# EAGLE design LV Relay Board v6 (EAGLE 7.2.0)
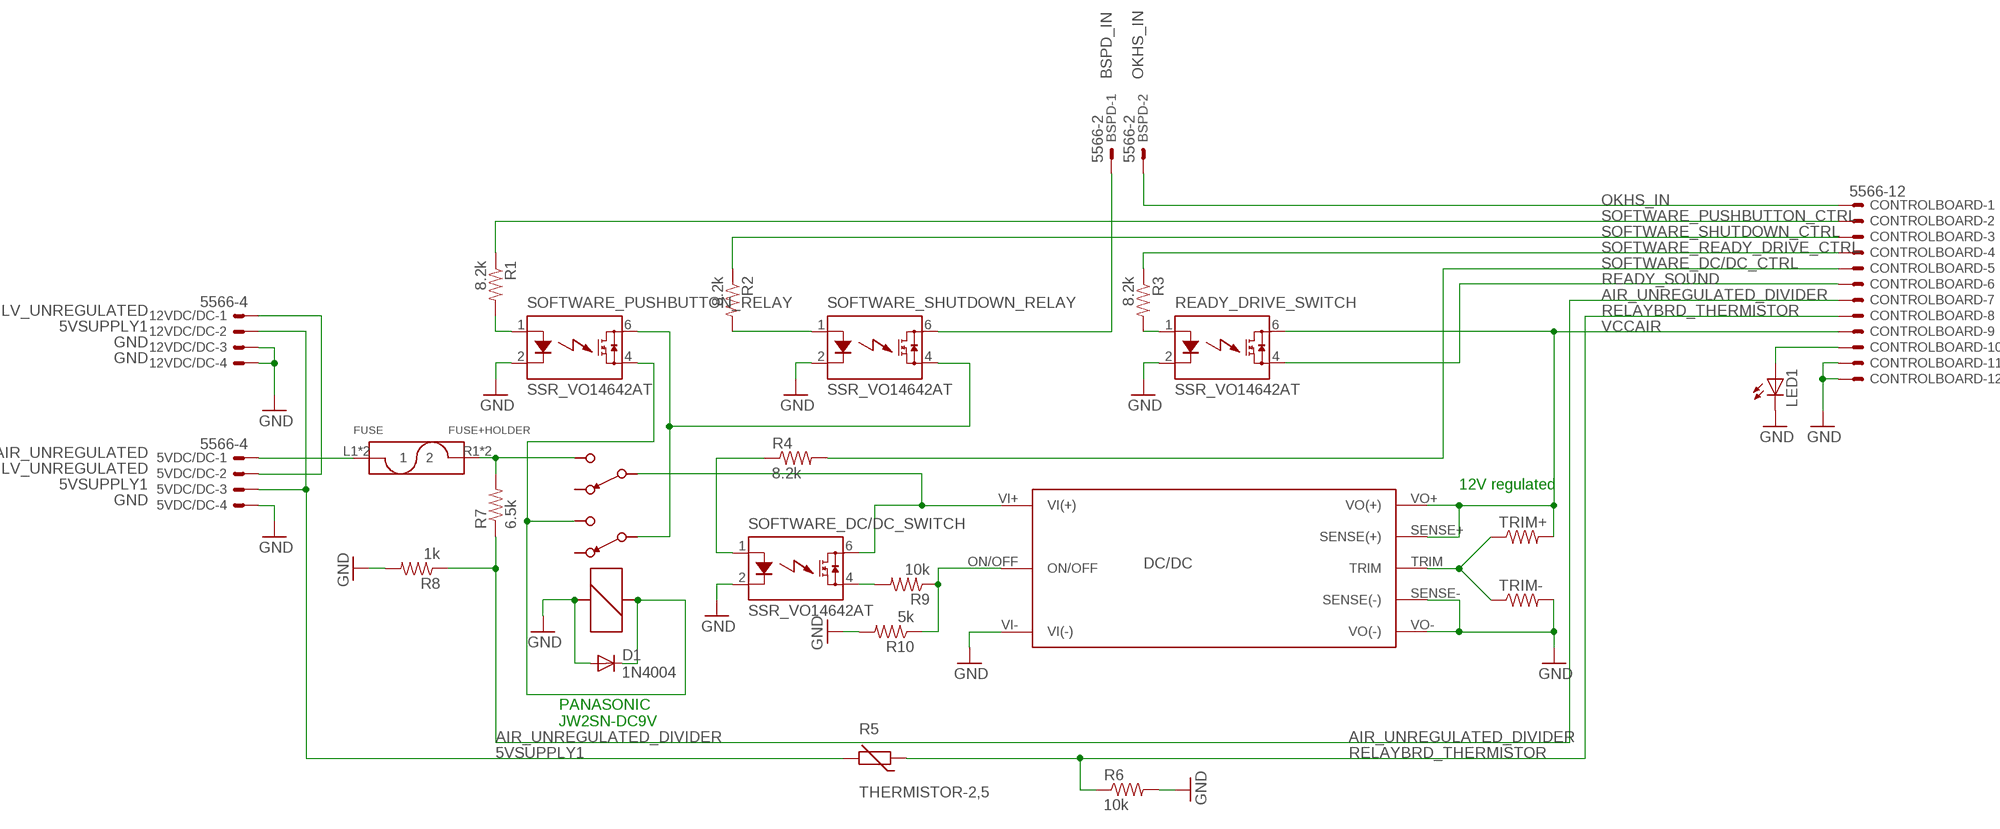
[diagram p0: schematic, sheet 1]

## Parts
5VDC/DC  5566-4  [5566-4]
12VDC/DC  5566-4  [5566-4]
BSPD  5566-2  [5566-2]
CONTROLBOARD  5566-12  [5566-12]
D1  1N4004  [DO41-10]
DC/DC  DC/DC-EIGHTH_BRICKUWE-12/10-Q12PB-C  [DC/DC-EIGHTH_BRICK]
FUSE  FUSE+HOLDER  [FUSE-HOLDER]
LED1  LED3MM  [LED3MM]
PANASONIC_JW2SN-DC9V_RELAY  PANASONIC_JW2SN-DC9V_RELAY  [PANASONIC_JW2SN-DC9V_RELAY]
R1  8.2k  RESISTORPTH-1/4W  [AXIAL-0.4]
R2  8.2k  RESISTORPTH-1/4W  [AXIAL-0.4]
R3  8.2k  RESISTORPTH-1/4W  [AXIAL-0.4]
R4  8.2k  RESISTORPTH-1/4W  [AXIAL-0.4]
R5  THERMISTOR-2,5  [RS-2,5]
R6  10k  RESISTORPTH-1/4W  [AXIAL-0.4]
R7  6.5k  RESISTORPTH-1/4W  [AXIAL-0.4]
R8  1k  RESISTORPTH-1/4W  [AXIAL-0.4]
R9  10k  RESISTORPTH-1/4W  [AXIAL-0.4]
R10  5k  RESISTORPTH-1/4W  [AXIAL-0.4]
READY_DRIVE_SWITCH  SSR_VO14642AT  [DIL06]
SOFTWARE_DC/DC_SWITCH  SSR_VO14642AT  [DIL06]
SOFTWARE_PUSHBUTTON_RELAY  SSR_VO14642AT  [DIL06]
SOFTWARE_SHUTDOWN_RELAY  SSR_VO14642AT  [DIL06]
TRIM+  RESISTORPTH-1/4W  [AXIAL-0.4]
TRIM-  RESISTORPTH-1/4W  [AXIAL-0.4]

## Nets
5VSUPPLY1: 5VDC/DC.3 12VDC/DC.2 R5.2
AIR_UNREGULATED: 5VDC/DC.1 FUSE.L1 FUSE.L2
AIR_UNREGULATED_DIVIDER: CONTROLBOARD.7 R7.P$1 R8.P$1
BSPD_IN: BSPD.1 SOFTWARE_SHUTDOWN_RELAY.6(IO1)
GND: 5VDC/DC.4 12VDC/DC.3 12VDC/DC.4 CONTROLBOARD.11 CONTROLBOARD.12 D1.A DC/DC.SENSE-(SENSE(-)) DC/DC.VI-(VI(-)) DC/DC.VO-(VO(-)) LED1.K(C) PANASONIC_JW2SN-DC9V_RELAY.COIL+ R6.P$2 R8.P$2 R10.P$2 READY_DRIVE_SWITCH.2(LED-) SOFTWARE_DC/DC_SWITCH.2(LED-) SOFTWARE_PUSHBUTTON_RELAY.2(LED-) SOFTWARE_SHUTDOWN_RELAY.2(LED-) TRIM-.P$2
LV_UNREGULATED: 5VDC/DC.2 12VDC/DC.1
N$1: R9.P$2 SOFTWARE_DC/DC_SWITCH.4(IO2)
N$2: DC/DC.VI+(VI(+)) PANASONIC_JW2SN-DC9V_RELAY.6 SOFTWARE_DC/DC_SWITCH.6(IO1)
N$3: FUSE.R1 FUSE.R2 PANASONIC_JW2SN-DC9V_RELAY.5 R7.P$2
N$4: PANASONIC_JW2SN-DC9V_RELAY.3 SOFTWARE_PUSHBUTTON_RELAY.6(IO1) SOFTWARE_SHUTDOWN_RELAY.4(IO2)
N$5: R1.P$2 SOFTWARE_PUSHBUTTON_RELAY.1(LED+)
N$6: D1.C PANASONIC_JW2SN-DC9V_RELAY.4 PANASONIC_JW2SN-DC9V_RELAY.COIL- SOFTWARE_PUSHBUTTON_RELAY.4(IO2)
N$7: R2.P$2 SOFTWARE_SHUTDOWN_RELAY.1(LED+)
N$8: DC/DC.TRIM TRIM+.P$1 TRIM-.P$1
N$9: R3.P$2 READY_DRIVE_SWITCH.1(LED+)
N$10: R4.P$1 SOFTWARE_DC/DC_SWITCH.1(LED+)
N$11: DC/DC.ON/OFF R9.P$1 R10.P$1
N$13: CONTROLBOARD.10 LED1.A
OKHS_IN: BSPD.2 CONTROLBOARD.1
READY_SOUND: CONTROLBOARD.6 READY_DRIVE_SWITCH.4(IO2)
RELAYBRD_THERMISTOR: CONTROLBOARD.8 R5.1 R6.P$1
SOFTWARE_DC/DC_CTRL: CONTROLBOARD.5 R4.P$2
SOFTWARE_PUSHBUTTON_CTRL: CONTROLBOARD.2 R1.P$1
SOFTWARE_READY_DRIVE_CTRL: CONTROLBOARD.4 R3.P$1
SOFTWARE_SHUTDOWN_CTRL: CONTROLBOARD.3 R2.P$1
VCCAIR: CONTROLBOARD.9 DC/DC.SENSE+(SENSE(+)) DC/DC.VO+(VO(+)) READY_DRIVE_SWITCH.6(IO1) TRIM+.P$2
Unconnected: PANASONIC_JW2SN-DC9V_RELAY.2 PANASONIC_JW2SN-DC9V_RELAY.7

## Notes on the sheet
- 12V regulated
- PANASONIC
  JW2SN-DC9V

## Library data of the parts
5VDC/DC 12VDC/DC = con-molex:5566-4: Mini FIT connector 4 pol Source: http://www.molex.com; OC_FARNELL: unknown; OC_NEWARK: unknown
BSPD = con-molex:5566-2: Mini FIT connector 2 pol Source: http://www.molex.com; OC_FARNELL: 1822072; OC_NEWARK: unknown
CONTROLBOARD = con-molex:5566-12: Mini FIT connector 12 pol Source: http://www.molex.com; OC_FARNELL: unknown; OC_NEWARK: unknown
D1 = diode:1N4004: DIODE general purpose rectifier, 1 A
DC/DC = HyTech 2016:DC/DC-EIGHTH_BRICK: Eighth Brick DC/DC
FUSE = HyTech 2016:FUSE+HOLDER
LED1 = adafruit:LED: LED OSRAM: - CHIPLED LG R971, LG N971, LY N971, LG Q971, LY Q971, LO R971, LY R971 LH N974, LH R974 LS Q976, LO Q976, LY Q976 LO Q996 - Hyper CHIPLED LW Q18S LB Q993, LB Q99A, LB R99A - SideLED LS A670, LO A670, LY A670, LG A670, LP A670 LB A673, LV A673, LT A673, LW A673 LH A674 LY A675 LS A676, LA A676, LO A676, LY A676, LW A676 LS A679, LY A679, LG A679 - Hyper Micro SIDELED® LS Y876, LA Y876, LO Y876, LY Y876 LT Y87S - SmartLED LW L88C, LW L88S LB L89C, LB L89S, LG L890 LS L89K, LO L89K, LY L89K LS L896, LA L896, LO L896, LY L896 - TOPLED LS T670, LO T670, LY T670, LG T670, LP T670 LSG T670, LSP T670, LSY T670, LOP T670, LYG T670 LG T671, LOG T671, LSG T671 LB T673, LV T673, LT T673, LW T673 LH T674 LS T676, LA T676, LO T676, LY T676, LB T676, LH T676, LSB T676, LW T676 LB T67C, LV T67C, LT T67C, LS T67K, LO T67K, LY T67K, LW E67C LS E67B, LA E67B, LO E67B, LY E67B, LB E67C, LV E67C, LT E67C LW T67C LS T679, LY T679, LG T679 LS T770, LO T770, LY T770, LG T770, LP T770 LB T773, LV T773, LT T773, LW T773 LH T774 LS E675, LA E675, LY E675, LS T675 LS T776, LA T776, LO T776, LY T776, LB T776 LHGB T686 LT T68C, LB T68C - Hyper Mini TOPLED® LB M676 - Mini TOPLED Santana® LG M470 LS M47K, LO M47K, LY M47K Source: http://www.osram.convergy.de/
PANASONIC_JW2SN-DC9V_RELAY = HyTech 2016:PANASONIC_JW2SN-DC9V_RELAY
R1-R4 R6-R10 TRIM+ TRIM- = HyTech 2016:RESISTOR: Resistor Basic schematic elements and footprints for 0603, 1206, and PTH resistors.
R5 = varistor:THERMISTOR: THERMISTOR
READY_DRIVE_SWITCH SOFTWARE_DC/DC_SWITCH SOFTWARE_PUSHBUTTON_RELAY SOFTWARE_SHUTDOWN_RELAY = HyTech 2016:SSR_: Configured for DC only

## Board
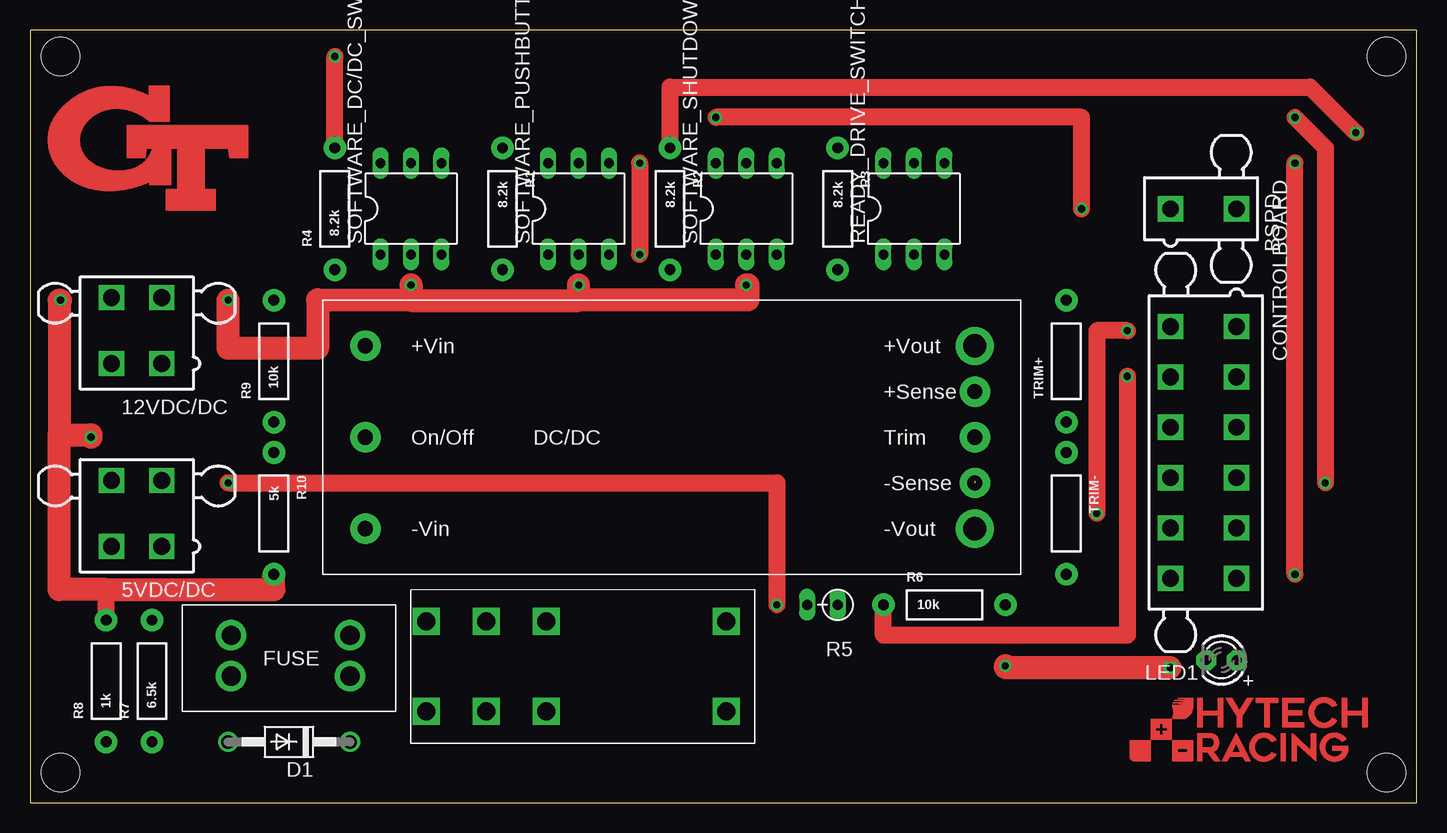
[diagram p1: board, top side]
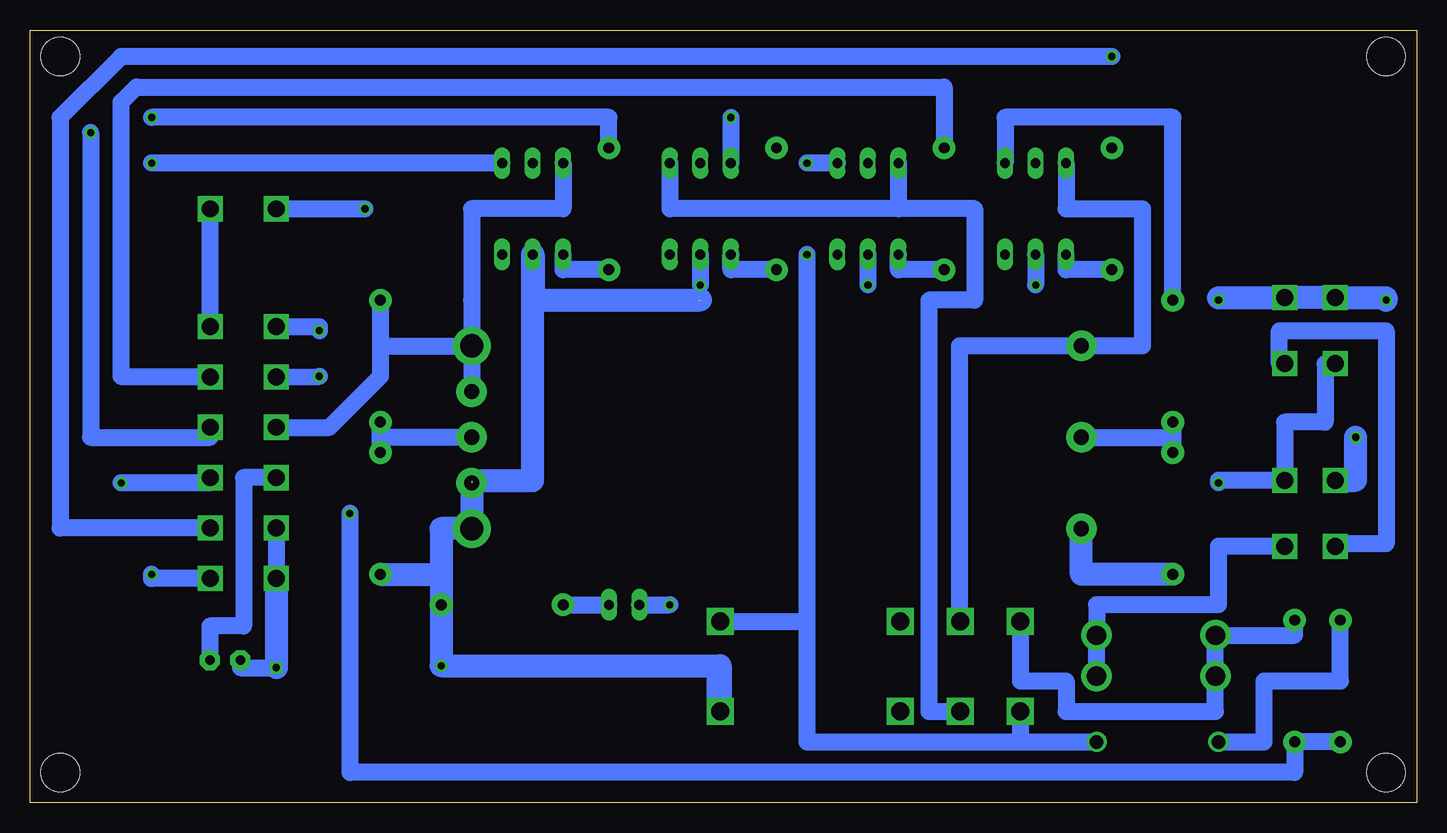
[diagram p2: board, bottom side, seen from below]

Size 115.55 x 64.44 mm. Coordinates in mm from the lower left corner, seen from the top.
Outline: 0,0 115.55,0 115.55,64.44 0,64.44 0,0
Copper layers (1*16): Top 0.035mm / dielectric 1.5mm / Bottom 0.035mm
Design rules "default": minimum track width 10mil, minimum drill 24mil, track to track 8mil, track to pad 8mil, pad to pad 8mil, via to via 8mil, smd to smd 8mil, copper to edge 40mil, drill to drill 8mil, minimum pad ring 10mil, minimum via ring 8mil, stop-mask expansion 4mil, vias tented up to drill 0mil, thermal gap 10mil
Holes 3.2 mm at 2.54,62.23 2.54,2.54 113.03,2.54 113.03,62.23

### Footprints (pad centres in the part's own frame; a part is rotated, then mirrored left to right if it is on the bottom)
5566-4 = drill 1.4 square: 1 2.1,-2.75; 2 -2.1,-2.75; 3 2.1,2.75; 4 -2.1,2.75
5566-2 = drill 1.4 square: 1 0,-2.75; 2 0,2.75
5566-12 = drill 1.4 square: 1 10.5,-2.75; 2 6.3,-2.75; 3 2.1,-2.75; 4 -2.1,-2.75; 5 -6.3,-2.75; 6 -10.5,-2.75; 7 10.5,2.75; 8 6.3,2.75; 9 2.1,2.75; 10 -2.1,2.75; 11 -6.3,2.75; 12 -10.5,2.75
DO41-10 = drill 1.118: A 5.08,0; C -5.08,0
DC/DC-EIGHTH_BRICK = drill 1.27 pad 2.54: ON/OFF 0,-7.62; SENSE+ 50.8,-3.81; SENSE- 50.8,-11.43; TRIM 50.8,-7.62; VI+ 0,0; VI- 0,-15.24 | drill 1.93 pad 3.175: VO+ 50.8,0; VO- 50.8,-15.24
FUSE-HOLDER = drill 1.6 pad 2.54: L1 0,3.404; L2 0,0; R1 9.906,3.404; R2 9.906,0
LED3MM = drill 0.813 pad 1.676 octagon: A -1.27,0; K 1.27,0
PANASONIC_JW2SN-DC9V_RELAY = drill 1.5 square: 2 10.008,0; 3 5.004,0; 4 0,0; 5 0,7.493; 6 5.004,7.493; 7 10.008,7.493; COIL+ 25.019,0; COIL- 25.019,7.493
AXIAL-0.4 = drill 0.9 pad 1.88: P$1 -5.08,0; P$2 5.08,0
RS-2,5 = drill 0.813 long: 1 -1.27,0; 2 1.27,0
DIL06 = drill 0.813 long: 1 -2.54,-3.81; 2 0,-3.81; 3 2.54,-3.81; 4 2.54,3.81; 5 0,3.81; 6 -2.54,3.81

### Placement (x,y rotation side)
5VDC/DC  8.89,24.13 0 top
12VDC/DC  8.89,39.37 0 top
BSPD  97.79,49.53 270 top
CONTROLBOARD  97.79,29.21 90 top
D1  21.59,5.08 180 top
DC/DC  27.94,38.1 0 top
FUSE  26.67,13.97 180 top
LED1  99.29,11.89 180 top
PANASONIC_JW2SN-DC9V_RELAY  33.02,7.62 0 top
R1  39.37,49.53 270 top
R2  53.34,49.53 270 top
R3  67.31,49.53 270 top
R4  25.4,49.53 90 top
R5  66.04,16.51 180 top
R6  76.2,16.51 0 top
R7  10.16,10.16 90 top
R8  6.35,10.16 90 top
R9  20.32,36.83 90 top
R10  20.32,24.13 270 top
READY_DRIVE_SWITCH  73.66,49.53 0 top
SOFTWARE_DC/DC_SWITCH  31.75,49.53 0 top
SOFTWARE_PUSHBUTTON_RELAY  45.72,49.53 0 top
SOFTWARE_SHUTDOWN_RELAY  59.69,49.53 0 top
TRIM+  86.36,36.83 90 top
TRIM-  86.36,24.13 270 top

### Tracks (layer width: path | path; a pad name or v marks a point on that pad's centre or on a via)
5VSUPPLY1  (via drill 0.6)
  Top 1.422: v16.51,26.67 62.23,26.67 v62.23,16.51
  Bottom 1.422: 12VDC/DC.2 7.62,36.62 7.62,31.75 10.99,31.75 5VDC/DC.3 16.51,26.88 v16.51,26.67 | R5.2 v62.23,16.51
AIR_UNREGULATED
  Bottom 1.422: FUSE.L1 FUSE.L2 26.67,16.51 16.51,16.51 16.51,21.38 5VDC/DC.1
AIR_UNREGULATED_DIVIDER  (via drill 0.6)
  Top 1.422: v91.44,39.37 88.9,39.37 v88.9,24.13
  Bottom 1.422: R8.P$1 R7.P$1 10.16,2.54 88.9,2.54 v88.9,24.13 | CONTROLBOARD.7 91.44,39.71 v91.44,39.37
BSPD_IN  (via drill 0.6)
  Top 1.422: v87.63,49.53 87.63,57.15 v57.15,57.15
  Bottom 1.422: BSPD.1 v87.63,49.53 | v57.15,57.15 SOFTWARE_SHUTDOWN_RELAY.6
GND  (via drill 0.6)  (2 unrouted)
  Top 1.422: R8.P$2 6.35,17.78 2.54,17.78
  Top 1.93: v31.75,43.18 v31.76,43.18 31.76,41.91 | 31.76,41.91 31.76,41.89 45.72,41.89 v45.72,43.18 45.72,41.92 59.81,41.92 59.81,43.18 v59.69,43.18 | 31.76,41.91 24.02,41.95 23.97,41.95 23.97,37.89 16.51,37.89 v16.51,41.91 | v2.54,41.91 2.42,41.91 2.42,30.69 | 2.42,30.69 5.08,30.69 v5.08,30.48 | 2.42,30.69 2.42,17.78 6.35,17.78 20.32,17.78 R10.P$2 | v95.02,11.27 81.28,11.27 v81.28,11.43
  Bottom 1.422: CONTROLBOARD.11 CONTROLBOARD.12 95.25,18.71 | SOFTWARE_SHUTDOWN_RELAY.2 v59.69,43.18 | D1.A 12.7,5.08 12.7,10.16 6.35,10.16 R8.P$2 | 16.51,42.12 v16.51,41.91 | SOFTWARE_DC/DC_SWITCH.2 v31.75,43.18 | SOFTWARE_PUSHBUTTON_RELAY.2 v45.72,43.18 | LED1.K 98.01,11.89 98.01,11.27 v95.02,11.27
  Bottom 1.93: R6.P$2 81.28,22.86 DC/DC.VO- 78.74,26.84 73.68,26.84 73.68,45.72 READY_DRIVE_SWITCH.2 73.63,45.72 73.63,41.92 59.69,41.92 | 16.51,42.12 12VDC/DC.3 12VDC/DC.4 | 12VDC/DC.4 2.54,42.12 v2.54,41.91 | 5VDC/DC.4 5.08,26.88 v5.08,30.48 | R10.P$2 27.94,19.05 DC/DC.VI- | R6.P$2 v81.28,11.43 58.04,11.43 PANASONIC_JW2SN-DC9V_RELAY.COIL+ 58.2,7.62 58.2,10.88 | TRIM-.P$2 81.28,19.05 R6.P$2 | CONTROLBOARD.12 95.02,18.71 v95.02,11.27 | 12VDC/DC.4 7.4,42.12 7.4,42.1
LV_UNREGULATED
  Bottom 1.422: 12VDC/DC.1 11.43,36.62 11.43,39.37 2.54,39.37 2.54,21.59 6.79,21.59 5VDC/DC.2
N$1
  Bottom 1.422: R9.P$2 20.32,57.15 34.29,57.15 SOFTWARE_DC/DC_SWITCH.4
N$2
  Bottom 1.422: SOFTWARE_DC/DC_SWITCH.6 29.21,49.53 22.86,49.53 22.86,38.1 DC/DC.VI+ 38.1,38.1 38.1,15.11 PANASONIC_JW2SN-DC9V_RELAY.6
N$3
  Bottom 1.422: R7.P$2 10.16,13.97 FUSE.R2 FUSE.R1 16.76,7.62 29.21,7.62 29.21,10.16 33.02,10.16 PANASONIC_JW2SN-DC9V_RELAY.5
N$4
  Bottom 1.422: SOFTWARE_PUSHBUTTON_RELAY.6 43.18,49.53 | PANASONIC_JW2SN-DC9V_RELAY.3 40.64,7.62 40.64,41.91 36.83,41.91 36.83,49.53 43.18,49.53 | SOFTWARE_SHUTDOWN_RELAY.4 62.23,49.53 43.18,49.53
N$5
  Bottom 1.422: R1.P$2 43.18,44.45 SOFTWARE_PUSHBUTTON_RELAY.1
N$6  (via drill 0.6)
  Top 1.422: v50.8,53.34 v50.8,45.72
  Bottom 1.422: SOFTWARE_PUSHBUTTON_RELAY.4 v50.8,53.34 | PANASONIC_JW2SN-DC9V_RELAY.4 33.02,5.08 | 33.02,5.08 D1.C | PANASONIC_JW2SN-DC9V_RELAY.COIL- 50.8,15.11 | 50.8,15.11 50.8,5.08 33.02,5.08 | v50.8,45.72 50.8,15.11
N$7
  Bottom 1.422: SOFTWARE_SHUTDOWN_RELAY.1 57.15,44.45 R2.P$2
N$8
  Bottom 1.422: DC/DC.TRIM 86.36,30.48 | 86.36,30.48 TRIM+.P$1 | TRIM-.P$1 86.36,30.48
N$9
  Bottom 1.422: R3.P$2 71.12,44.45 READY_DRIVE_SWITCH.1
N$10
  Bottom 1.422: R4.P$1 29.21,44.45 SOFTWARE_DC/DC_SWITCH.1
N$11
  Bottom 1.422: R9.P$1 20.32,30.48 | 20.32,30.48 R10.P$1 | DC/DC.ON/OFF 20.32,30.48
N$13
  Bottom 1.422: CONTROLBOARD.10 97.74,27.11 97.74,14.74 100.56,14.74 LED1.A
OKHS_IN
  Bottom 1.422: CONTROLBOARD.1 BSPD.2
READY_SOUND  (via drill 0.6)
  Top 1.422: v105.41,19.05 v105.41,53.34
  Bottom 1.422: CONTROLBOARD.6 105.41,18.71 v105.41,19.05 | READY_DRIVE_SWITCH.4 v105.41,53.34
RELAYBRD_THERMISTOR  (via drill 0.6)
  Top 1.422: v91.44,35.56 91.44,13.97 71.12,13.97 R6.P$1
  Bottom 1.422: R6.P$1 R5.1 | CONTROLBOARD.8 v91.44,35.56
SOFTWARE_DC/DC_CTRL  (via drill 0.6)
  Top 1.422: R4.P$2 v25.4,62.23
  Bottom 1.422: CONTROLBOARD.5 113.03,22.91 113.03,57.15 107.95,62.23 v25.4,62.23
SOFTWARE_PUSHBUTTON_CTRL
  Bottom 1.422: CONTROLBOARD.2 107.9,35.51 107.95,35.56 107.95,58.42 106.68,59.69 39.37,59.69 R1.P$1
SOFTWARE_READY_DRIVE_CTRL  (via drill 0.6)
  Top 1.422: v107.95,26.67 107.95,54.61 v105.41,57.15
  Bottom 1.422: R3.P$1 67.31,57.15 v105.41,57.15 | CONTROLBOARD.4 100.54,26.67 v107.95,26.67
SOFTWARE_SHUTDOWN_CTRL  (via drill 0.6)
  Top 1.422: R2.P$1 53.34,59.69 106.68,59.69 v110.49,55.88
  Bottom 1.422: v110.49,55.88 110.49,30.48 100.54,30.48 CONTROLBOARD.3
VCCAIR
  Bottom 1.422: READY_DRIVE_SWITCH.6 71.12,49.53 78.74,49.53 DC/DC.VO+ | 78.74,41.91 DC/DC.VO+ | DC/DC.VO+ DC/DC.SENSE+ | TRIM+.P$2 86.36,38.1 | 86.36,38.1 DC/DC.VO+ | 86.36,38.1 86.36,35.56 90.61,31.31 CONTROLBOARD.9
(copper drawn outside any net)
  shapes: Top area x3696